# EAGLE design OBKP_Effector_PCB (EAGLE 6.5.0)
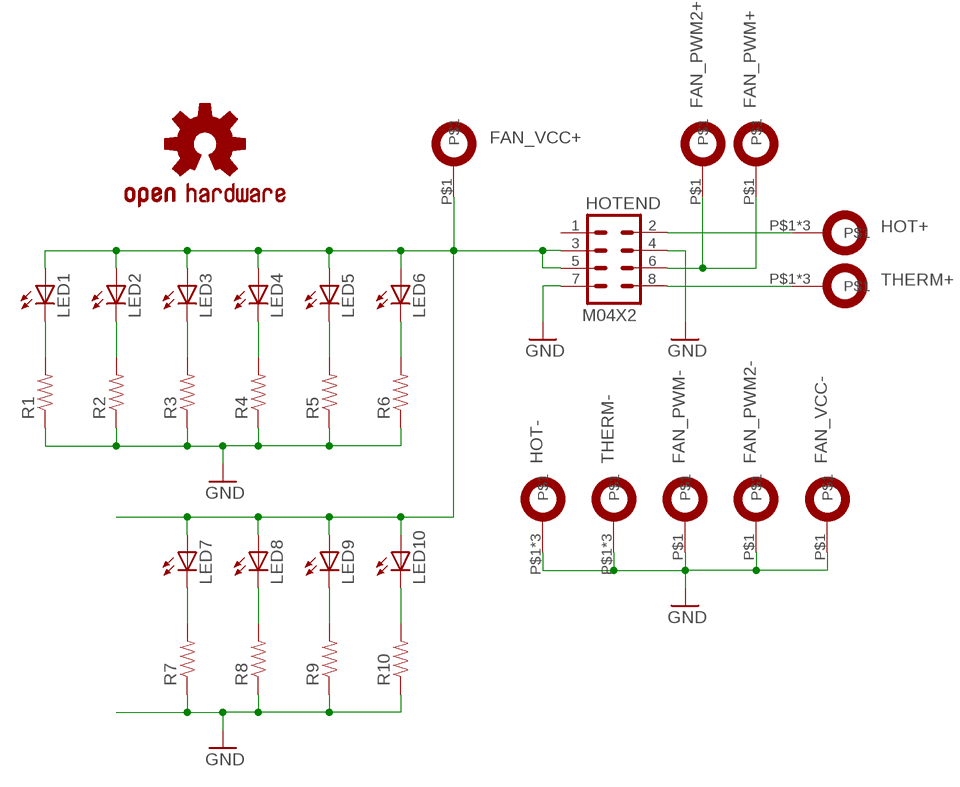
[diagram p0: schematic, sheet 1]

## Parts
FAN_PWM2+  LUG2.3  [2.3MM]
FAN_PWM2-  LUG2.3  [2.3MM]
FAN_PWM+  LUG2.3  [2.3MM]
FAN_PWM-  LUG2.3  [2.3MM]
FAN_VCC+  LUG2.3  [2.3MM]
FAN_VCC-  LUG2.3  [2.3MM]
HOT+  LUG3-X  [3MM]
HOT-  LUG3-X  [3MM]
HOTEND  M04X2  [2X4]
LED1  LED0805  [CHIPLED_0805]
LED2  LED0805  [CHIPLED_0805]
LED3  LED0805  [CHIPLED_0805]
LED4  LED0805  [CHIPLED_0805]
LED5  LED0805  [CHIPLED_0805]
LED6  LED0805  [CHIPLED_0805]
LED7  LED0805  [CHIPLED_0805]
LED8  LED0805  [CHIPLED_0805]
LED9  LED0805  [CHIPLED_0805]
LED10  LED0805  [CHIPLED_0805]
LOGO1  OSHW-LOGOS  [OSHW-LOGO-S]
R1  RESISTOR0805-RES  [0805]
R2  RESISTOR0805-RES  [0805]
R3  RESISTOR0805-RES  [0805]
R4  RESISTOR0805-RES  [0805]
R5  RESISTOR0805-RES  [0805]
R6  RESISTOR0805-RES  [0805]
R7  RESISTOR0805-RES  [0805]
R8  RESISTOR0805-RES  [0805]
R9  RESISTOR0805-RES  [0805]
R10  RESISTOR0805-RES  [0805]
THERM+  LUG3-X  [3MM]
THERM-  LUG3-X  [3MM]

## Nets
FAN_VCC: FAN_VCC+.P$1 HOTEND.3 HOTEND.5 LED1.A LED2.A LED3.A LED4.A LED5.A LED6.A LED7.A LED8.A LED9.A LED10.A
GND: FAN_PWM2-.P$1 FAN_PWM-.P$1 FAN_VCC-.P$1 HOT-.P$1 HOT-.P$2 HOT-.P$3 HOTEND.4 HOTEND.7 R1.1 R2.1 R3.1 R4.1 R5.1 R6.1 R7.1 R8.1 R9.1 R10.1 THERM-.P$1 THERM-.P$2 THERM-.P$3
N$1: LED1.C R1.2
N$2: LED2.C R2.2
N$3: LED3.C R3.2
N$4: LED4.C R4.2
N$5: LED5.C R5.2
N$6: LED6.C R6.2
N$7: LED7.C R7.2
N$9: LED8.C R8.2
N$10 [high current]: HOT+.P$1 HOT+.P$2 HOT+.P$3 HOTEND.2
N$11: HOTEND.8 THERM+.P$1 THERM+.P$2 THERM+.P$3
N$12: FAN_PWM2+.P$1 FAN_PWM+.P$1 HOTEND.6
N$13: LED9.C R9.2
N$14: LED10.C R10.2
Unconnected: HOTEND.1

## Library data of the parts
FAN_PWM2+ FAN_PWM2- FAN_PWM+ FAN_PWM- FAN_VCC+ FAN_VCC- HOT+ HOT- THERM+ THERM- = OBKP_Effector_PCB:LUG
HOTEND = SparkFun-Connectors:M04X2: .1" header, two rows of four.
LED1-LED10 = SparkFun-LED:LED: LEDs Standard schematic elements and footprints for 5mm, 3mm, 1206, and 0603 sized LEDs. 5mm - Spark Fun Electronics SKU : COM-00529 (and others)
LOGO1 = SparkFun-Aesthetics:OSHW-LOGO: Open Source Hardware Logo This logo indicates the piece of hardware it is found on incorporates a OSHW license and/or adheres to the definition of open source hardware found here: http://freedomdefined.org/OSHW
R1-R10 = SparkFun-Passives:RESISTOR: Resistor Basic schematic elements and footprints for 0603, 1206, and PTH resistors.

## Net classes
0 default: width 0.203 mm, drill 0.305 mm, clearance 0.203 mm
1 high current: width 0.762 mm, drill 0.457 mm, clearance 0.203 mm

## Board
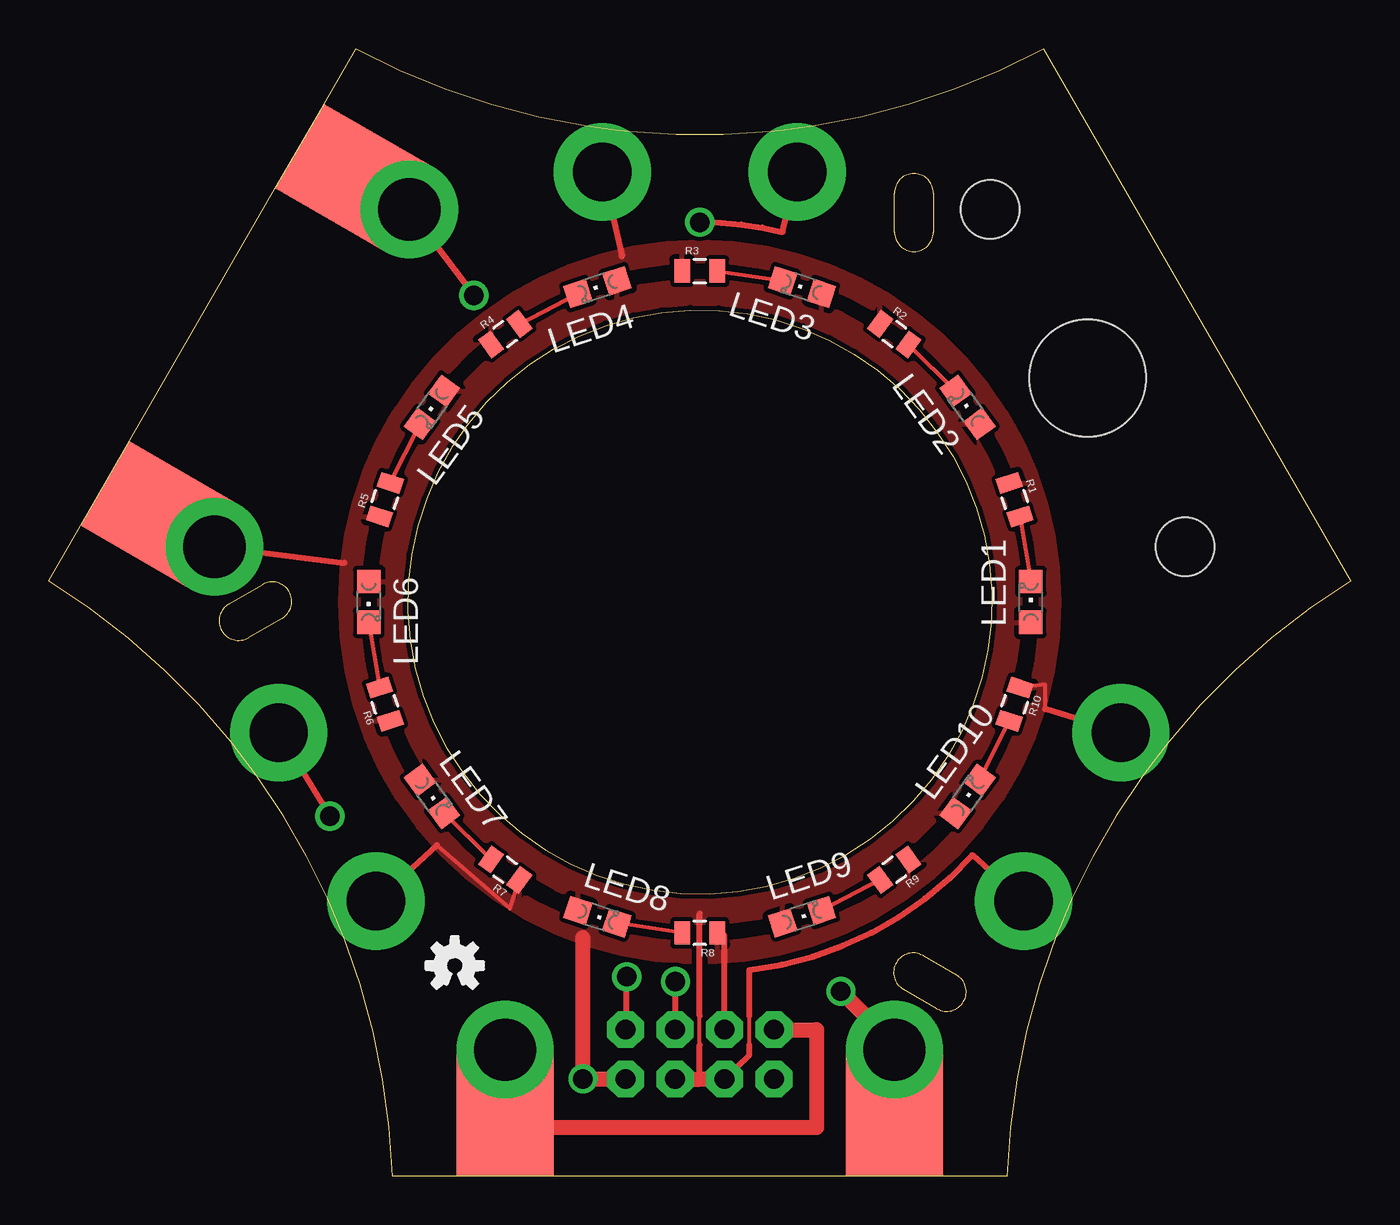
[diagram p1: board, top side]
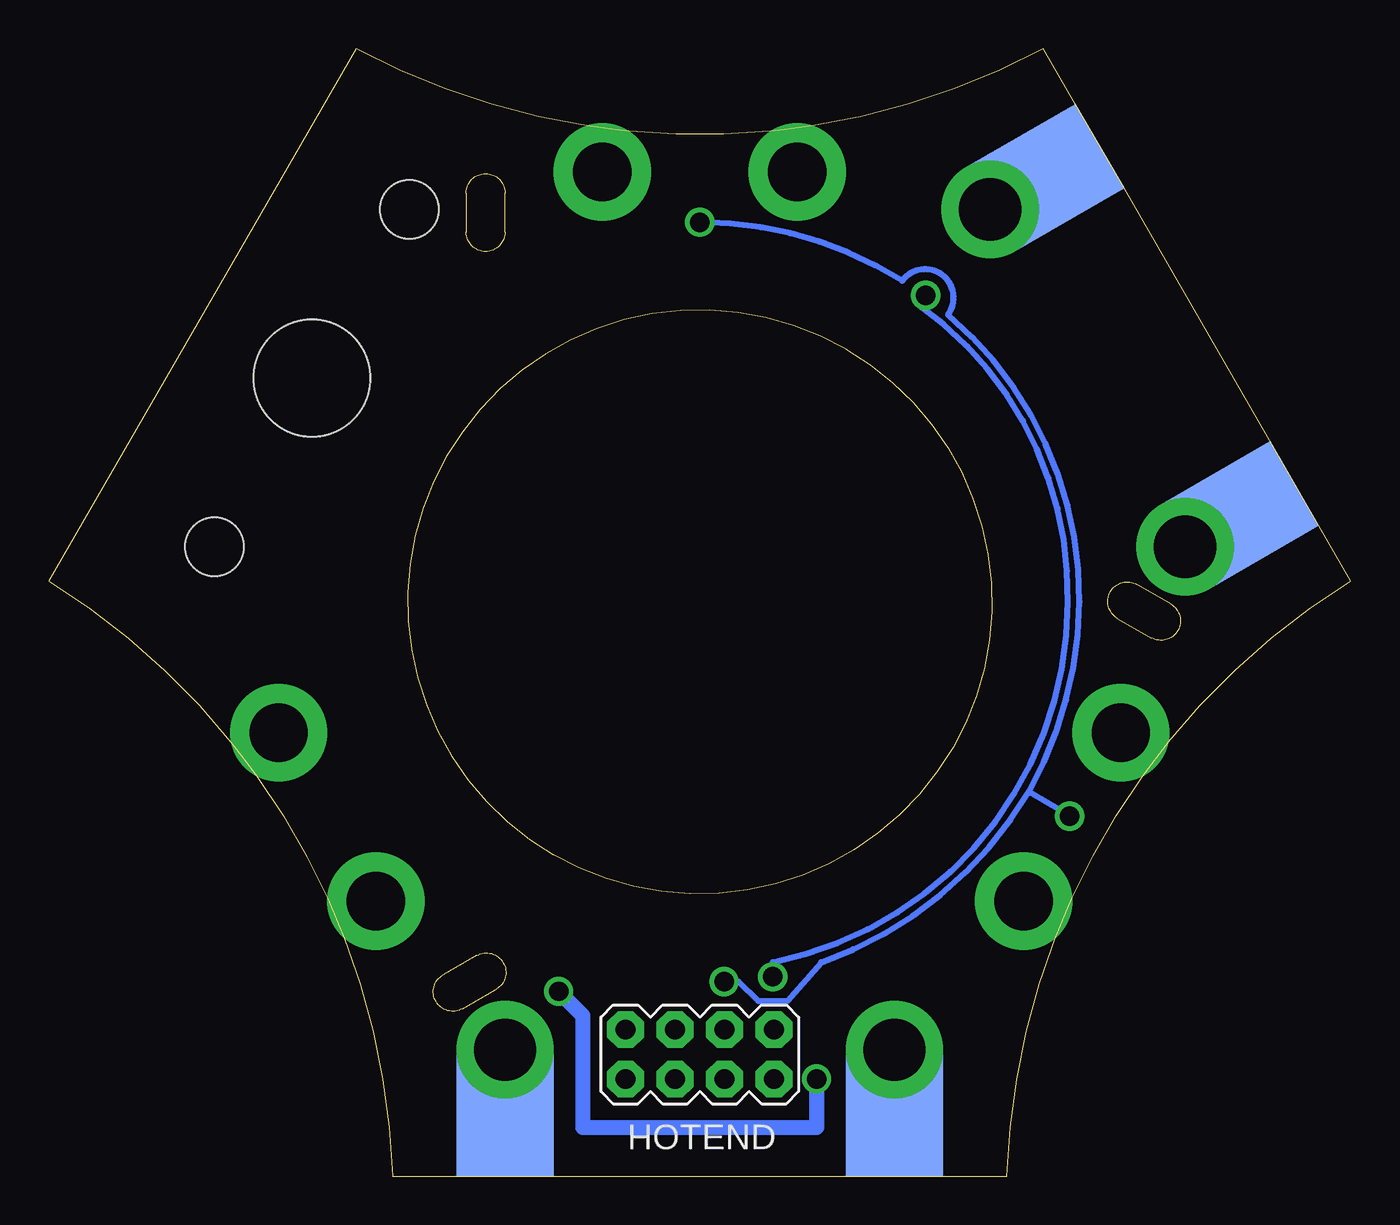
[diagram p2: board, bottom side, seen from below]

Size 66.88 x 57.92 mm. Coordinates in mm from the lower left corner, seen from the top.
Outline: 27.63,53.95 arc-19 15.78,57.92 14.14,55.08 11.64,50.74 1.64,33.42 0,30.58 arc-19 9.36,22.3 arc-3 10.69,20.56 arc-11 14.32,14.27 arc-3 15.17,12.25 arc-19 17.66,0 20.94,0 40.94,0 45.94,0 49.22,0 arc-19 51.71,12.25
Outline: 29.81,53.68 arc11 37.07,53.68
Outline: 27.63,53.95 arc3 29.81,53.68
Outline: 37.07,53.68 arc3 39.24,53.95 arc19 51.1,57.92 66.88,30.58 arc19 57.52,22.3 arc3 56.19,20.55 arc11 52.56,14.27 arc3 51.71,12.25
Outline: 9.25,29.39 arc180 10.25,27.66 11.98,28.66 arc180 10.98,30.39 9.25,29.39
Outline: 44.89,11.34 arc180 43.89,9.61 45.63,8.61 arc180 46.63,10.34 44.89,11.34
Outline: 43.44,48.5 arc180 45.44,48.5 45.44,50.5 arc180 43.44,50.5 43.44,48.5
Outline: 25.94,42.49 arc180 40.94,16.51 arc180 25.94,42.49
Copper layers (1*2*15*16): Top 0.035mm / dielectric 0.2mm / layer 2 0.0175mm / dielectric 1.1mm / layer 15 0.0175mm / dielectric 0.2mm / Bottom 0.035mm
Design rules "SeeedStudio_DRU_no_angle_20130527": minimum track width 6mil, minimum drill 12mil, track to track 6mil, track to pad 6mil, pad to pad 6mil, via to via 6mil, smd to smd 0mil, copper to edge 10mil, drill to drill 10mil, minimum pad ring 6mil, minimum via ring 6mil, stop-mask expansion 2mil, vias tented up to drill 25mil, thermal gap 10mil
Holes 3 mm at 58.36,32.34 48.36,49.66
Holes 6 mm at 53.36,41

### Footprints (pad centres in the part's own frame; a part is rotated, then mirrored left to right if it is on the bottom)
2.3MM = drill 3 pad 5: P$1 0,0
3MM = drill 3.2 pad 5: P$1 0,0 | smd 5 x 6.5: P$2 0,-3.25 | smd 5 x 6.5 bottom: P$3 0,-3.25
2X4 = drill 1.016 pad 1.88 octagon: 1 -3.81,-1.27; 2 -3.81,1.27; 3 -1.27,-1.27; 4 -1.27,1.27; 5 1.27,-1.27; 6 1.27,1.27; 7 3.81,-1.27; 8 3.81,1.27
CHIPLED_0805 = smd 1.2 x 1.2: A -1.05,0; C 1.05,0
0805 = smd 0.8 x 1.2: 1 -0.9,0; 2 0.9,0

### Placement (x,y rotation side)
FAN_PWM2+  11.81,22.79 300 top
FAN_PWM2-  16.81,14.13 300 top
FAN_PWM+  38.44,51.59 0 top
FAN_PWM-  28.44,51.59 0 top
FAN_VCC+  50.07,14.13 330 top
FAN_VCC-  55.07,22.79 330 top
HOT+  23.44,6.5 0 top
HOT-  43.44,6.5 0 top
HOTEND  33.44,6.26 0 bottom
LED1  50.44,29.5 90 top
LED2  47.19,39.49 126 top
LED3  38.69,45.67 162 top
LED4  28.19,45.67 198 top
LED5  19.69,39.49 234 top
LED6  16.44,29.5 270 top
LED7  19.69,19.51 306 top
LED8  28.19,13.33 342 top
LED9  38.69,13.33 18 top
LED10  47.19,19.51 54 top
LOGO1  20.85,10.82 0 top
R1  49.61,34.75 288 top
R2  43.43,43.25 324 top
R3  33.44,46.5 0 top
R4  23.45,43.25 36 top
R5  17.27,34.75 72 top
R6  17.27,24.25 108 top
R7  23.45,15.75 144 top
R8  33.44,12.5 180 top
R9  43.43,15.75 216 top
R10  49.61,24.25 252 top
THERM+  18.52,49.66 240 top
THERM-  8.52,32.34 240 top

### Tracks (layer width: path | path; a pad name or v marks a point on that pad's centre or on a via)
FAN_VCC
  Top 0.203: 33.44,6.75 33.44,8.25 | 35.99,6.75 35.99,8.25
  Top 0.305: 33.44,4.99 33.44,6.75 | 33.44,8.25 33.44,13.5 | HOTEND.3 35.99,6.22 35.99,6.75 | 35.99,8.25 35.99,10.6 arc41 47.44,16.5 FAN_VCC+.P$1
  Top 0.762: HOTEND.5 33.44,4.99 HOTEND.3
  pour Top: 16.94,29.5 arc90 33.44,13 arc90 49.94,29.5 arc90 33.44,46 arc90
GND  (via drill 1)
  Top 0.203: 51.19,24 51.19,25.25 R10.1 | 19.94,17 23.69,13.75 R7.1
  Top 0.305: HOTEND.4 34.71,12.37 R8.1 | FAN_VCC-.P$1 51.19,24 | FAN_PWM2-.P$1 19.94,17 | FAN_PWM-.P$1 29.44,47.25 | THERM-.P$1 15.19,31.5
  Top 0.762: HOT-.P$3 HOT-.P$1 43.44,6.75 v40.69,9.5 | v27.44,5 HOTEND.7 v27.44,4.99 27.44,12.25 | THERM-.P$3 THERM-.P$1
  Bottom 0.762: HOT-.P$1 HOT-.P$3 | v27.44,5 27.44,2.5 39.44,2.5 39.44,8.25 v40.69,9.5 | THERM-.P$3 THERM-.P$1
  pour Top: 33.44,47 arc-90 50.94,29.5 arc-90 33.94,12 33.94,11 arc89 51.94,29.5 arc90 33.44,48 arc90 14.94,29.5 arc89 32.94,11 32.94,12 arc-90 15.94,29.5 arc-90
N$1
  Top 0.203: R1.2 LED1.C
N$2
  Top 0.203: R2.2 LED2.C
N$3
  Top 0.203: R3.2 LED3.C
N$4
  Top 0.203: R4.2 LED4.C
N$5
  Top 0.203: R5.2 LED5.C
N$6
  Top 0.203: LED6.C R6.2
N$7
  Top 0.203: R7.2 LED7.C
N$9
  Top 0.203: R8.2 LED8.C
N$10
  Top 0.762: HOTEND.2 39.44,7.53 39.44,2.5 23.44,2.5 HOT+.P$2 HOT+.P$1
  Bottom 0.762: HOT+.P$2 HOT+.P$1
N$11  (via drill 1)
  Top 0.305: HOTEND.8 29.69,7.59 v29.69,10.25 | v21.84,45.25 THERM+.P$1
  Top 0.762: THERM+.P$3 THERM+.P$1
  Bottom 0.305: v29.69,10.25 29.69,11 arc-79 14.54,29.5 arc-56 22.19,44.75 v21.84,45.25
  Bottom 0.762: THERM+.P$3 THERM+.P$1
N$12  (via drill 1)
  Top 0.305: HOTEND.6 32.19,7.55 v32.19,10 | v33.44,49 arc-15 37.69,48.5 FAN_PWM+.P$1 | FAN_PWM2+.P$1 v14.44,18.5
  Bottom 0.305: v32.19,10 31.44,10 30.44,9 28.94,9 27.19,11 arc-40 16.54,19.75 | 16.54,19.75 arc-29 13.94,29.5 arc-50 20.69,44.25 arc-180 23.04,46 arc-32 v33.44,49 | v14.44,18.5 16.54,19.75
N$13
  Top 0.203: R9.2 LED9.C
N$14
  Top 0.203: R10.2 LED10.C